# Altium schematic sheet Power.SchDoc (part 3 of 3)
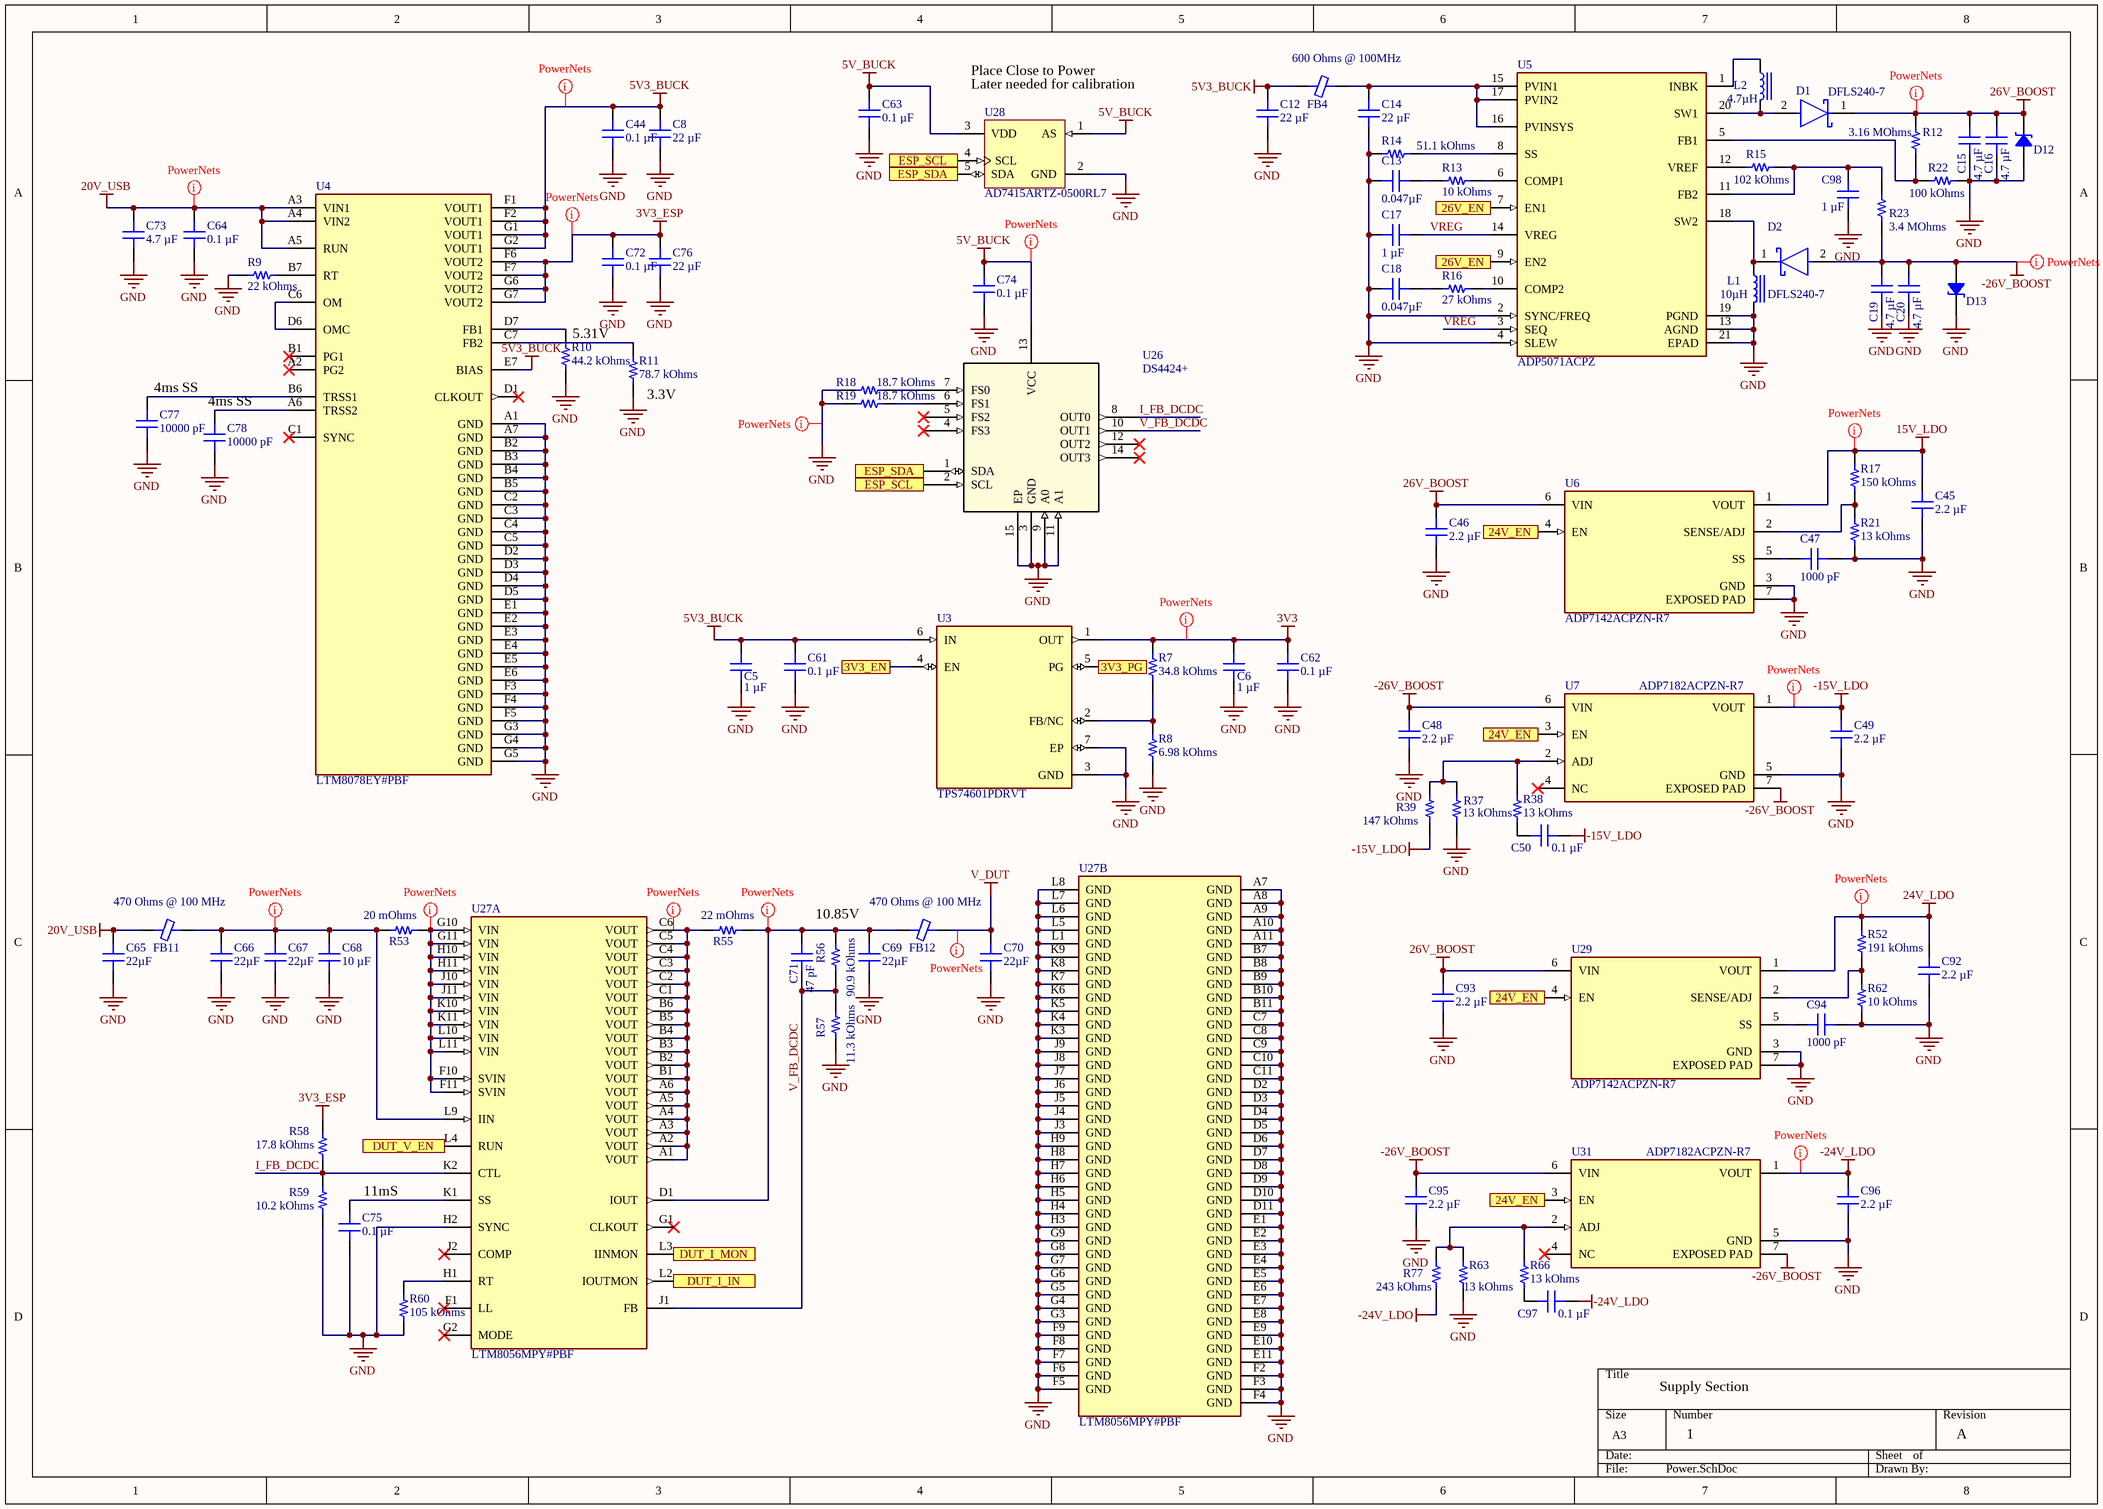
[diagram p2: Power.SchDoc]

## Library data of the parts (continued)
U28 = AD7415ARTZ-0500RL7: +/-0.5 degrees C Accurate, 10-Bit Digital Temperature Sensor, 2.7 to 5.5 V Supply, Industrial, 5-pin SOT23 (RJ-5), Reel; Manufacturer: Analog Devices; Code_JEDEC: MO-178-AA; ComponentLink3URL: http://www.analog.com/static/imported-files/packages/PKG_PDF/SOT-23(RJ)/RJ_5.pdf; ComponentLink3Description: Package Specification; PartNumber: AD7415ARTZ-0500RL7; PackageDescription: 5-Pin Small Outline Transistor Package, Body 2.9 x 1.6 mm, Pitch 0.95 mm; Supply Voltage Range: 2.7 to 5.5 V; Packing: Reel; DatasheetVersion: Rev. F; Mounting Technology: Surface Mount; PackageVersion: 121608-A , 12/2008; ComponentLink1URL: http://www.analog.com/en/index.html; PackageReference: RJ-5; ComponentLink4Description: Product URL; ComponentLink4URL: http://www.analog.com/en/mems-sensors/digital-temperature-sensors/ad7415/products/product.html; ComponentLink2Description: Datasheet; ComponentLink2URL: http://www.analog.com/static/imported-files/data_sheets/AD7414_7415.pdf; ComponentLink1Description: Manufacturer URL